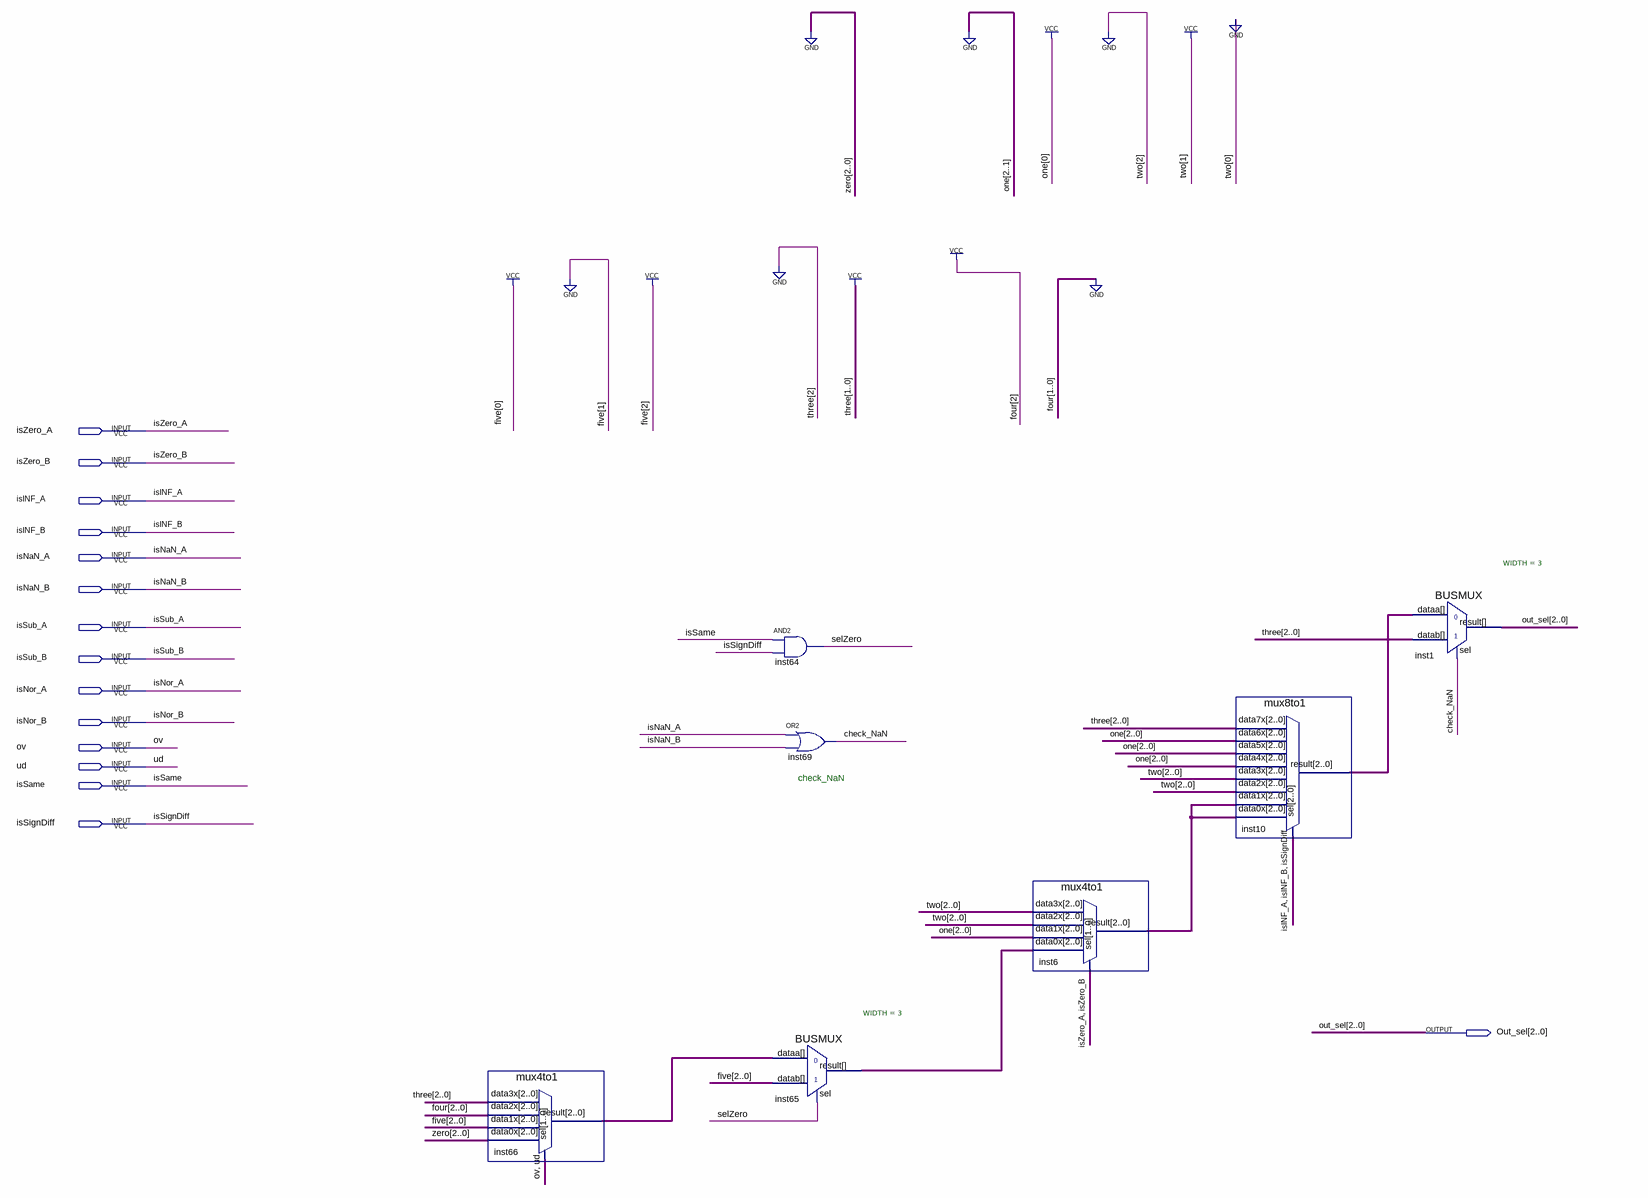
[diagram p0: schematic sheet]
// Quartus schematic add_sub_control_unit.bdf as structural Verilog: 7 symbols, 15 pins
module add_sub_control_unit (
  input  isZero_A,
  input  isZero_B,
  input  isINF_A,
  input  isINF_B,
  input  isNaN_A,
  input  isNaN_B,
  input  isSub_A,
  input  isSub_B,
  input  isNor_A,
  input  isNor_B,
  input  ov,
  input  ud,
  input  isSame,
  input  isSignDiff,
  output [2:0] Out_sel
);

  wire check_NaN, selZero;
  wire [2:0] inst6_result, inst10_result, inst65_result, inst66_result;

  mux4to1 inst66 (
    .data3x(3'b011), .data2x(3'b100), .data1x(3'b101), .data0x(3'b000), .sel({ov, ud}), .result(inst66_result));
  and inst64 (selZero, isSame, isSignDiff);
  or inst69 (check_NaN, isNaN_A, isNaN_B);
  BUSMUX #(.WIDTH(3)) inst65 (.datab(3'b101), .sel(selZero), .dataa(inst66_result), .result(inst65_result));
  mux4to1 inst6 (
    .data3x(3'b010), .data2x(3'b010), .data1x(3'b001), .data0x(inst65_result), .sel({isZero_A, isZero_B}),
    .result(inst6_result));
  mux8to1 inst10 (
    .data7x(3'b011), .data6x(3'b001), .data5x(3'b001), .data4x(3'b001), .data3x(3'b010), .data2x(3'b010),
    .data1x(inst6_result), .data0x(inst6_result), .sel({isINF_A, isINF_B, isSignDiff}), .result(inst10_result));
  BUSMUX #(.WIDTH(3)) inst1 (.datab(3'b011), .sel(check_NaN), .dataa(inst10_result), .result(Out_sel));

  // Notes on the sheet:
  //   check_NaN
endmodule
